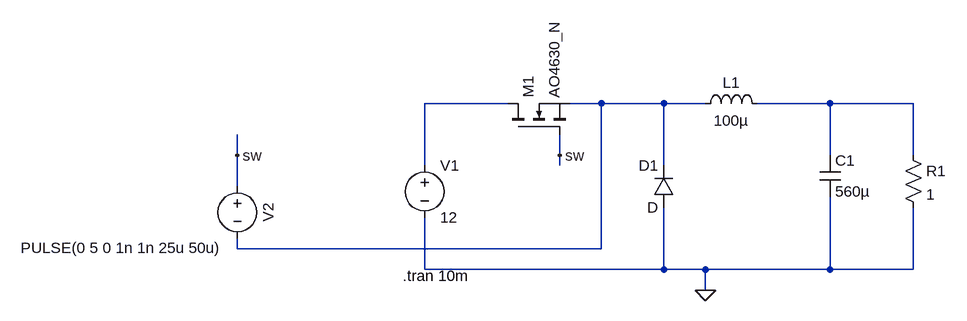
[diagram p0: schematic buck.asc]
buck.asc, the LTspice schematic file:
Version 4
SHEET 1 888 680
WIRE 208 160 80 160
WIRE 352 160 304 160
WIRE 448 160 352 160
WIRE 512 160 448 160
WIRE 704 160 592 160
WIRE 832 160 704 160
WIRE -208 240 -208 208
WIRE 288 240 288 208
WIRE 704 240 704 160
WIRE 832 240 832 160
WIRE 80 256 80 160
WIRE 288 256 288 240
WIRE 448 256 448 160
WIRE -208 288 -208 240
WIRE -208 384 -208 368
WIRE 352 384 352 160
WIRE 352 384 -208 384
WIRE 80 416 80 336
WIRE 448 416 448 320
WIRE 448 416 80 416
WIRE 512 416 448 416
WIRE 704 416 704 304
WIRE 704 416 512 416
WIRE 832 416 832 320
WIRE 832 416 704 416
WIRE 512 448 512 416
FLAG 512 448 0
FLAG 288 240 sw
FLAG -208 240 sw
SYMBOL voltage 80 240 R0
WINDOW 123 0 0 Left 0
WINDOW 39 0 0 Left 0
SYMATTR InstName V1
SYMATTR Value 12
SYMBOL voltage -208 272 R0
WINDOW 0 32 56 VTop 2
WINDOW 3 -178 126 Bottom 2
WINDOW 123 0 0 Left 0
WINDOW 39 0 0 Left 0
SYMATTR InstName V2
SYMATTR Value PULSE(0 5 0 1n 1n 25u 50u)
SYMBOL res 816 224 R0
SYMATTR InstName R1
SYMATTR Value 1
SYMBOL ind 496 176 R270
WINDOW 0 32 56 VTop 2
WINDOW 3 5 56 VBottom 2
SYMATTR InstName L1
SYMATTR Value 100µ
SYMBOL cap 688 240 R0
SYMATTR InstName C1
SYMATTR Value 560µ
SYMBOL nmos 208 208 R270
SYMATTR InstName M1
SYMATTR Value AO4630_N
SYMBOL diode 464 320 R180
WINDOW 0 24 64 Left 2
WINDOW 3 24 0 Left 2
SYMATTR InstName D1
TEXT 46 426 Left 2 !.tran 10m

The netlist it stands for:
* buck.asc
V1 N001 0 12
V2 sw N002 PULSE(0 5 0 1n 1n 25u 50u)
R1 N003 0 1
L1 N002 N003 100µ
C1 N003 0 560µ
M1 N001 sw N002 N002 AO4630_N
D1 0 N002 D
.model D D
.lib standard.dio
.model NMOS NMOS
.model PMOS PMOS
.lib standard.mos
.tran 10m
.backanno
.end